# Altium project MB1635.PrjPcb (part 4 of 4)
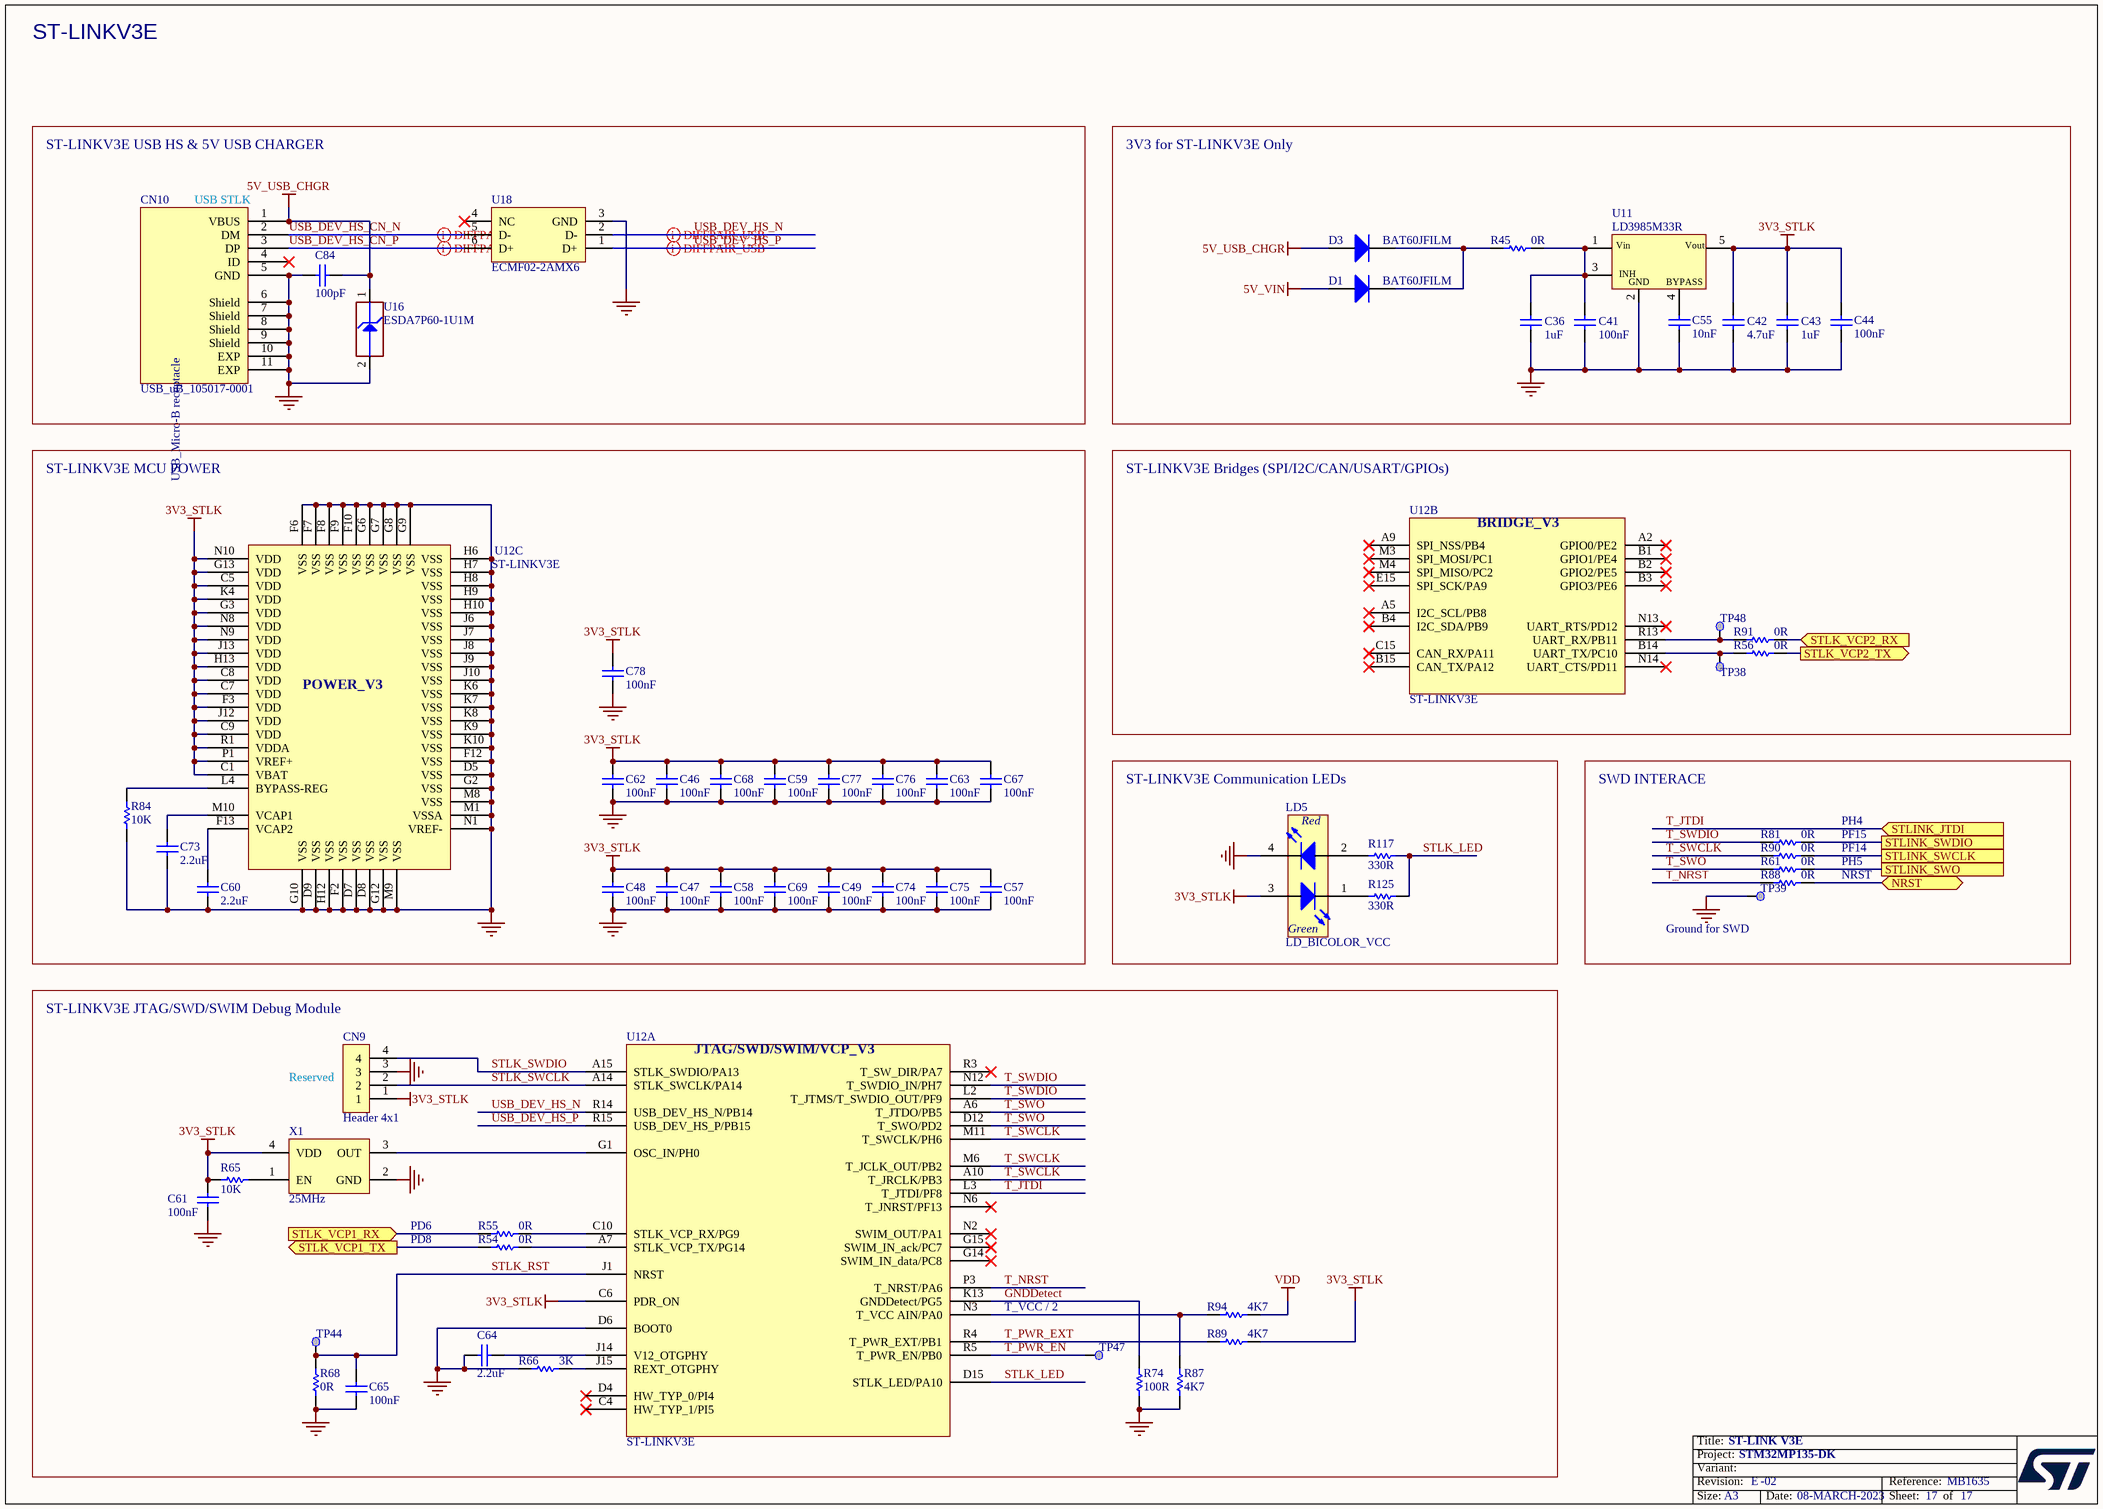
[diagram p9: ST-Link_V3E.SchDoc]

## Nets that join several sheets
3V3_AO: Power_Board (7 pins), Expansion_Connector (C7.1 CN8.1 CN8.17), MCP_IO_expander (C22.2 C23.2 R9.1 U5.5)
3V3_SW: Power_Board (TP49.1 U19.38), LCD4.3 (C50.1 C53.2 CN16.4)
5V_VIN: Power_Board (25 pins), LCD4.3 (R35.1), USB_TypeC_DRP (C86.2 Q1.5 Q1.6), Expansion_Connector (C8.2 CN8.2 CN8.4), ST-Link_V3E (D1.1)
GND: MP135_11x11 (9 pins), Power_MPU (112 pins), Power_Board (62 pins), LCD4.3 (23 pins), USB_TypeC_DRP (29 pins), Expansion_Connector (10 pins), MCP_IO_expander (6 pins), ST-Link_V3E (87 pins)
PWR_ON_DB: Power_Board (U19.35), USB_TypeC_DRP (C102.2 Q2.5 Q2.6)
VDD: MP135_11x11 (8 pins), Power_MPU (35 pins), Power_Board (9 pins), USB_TypeC_DRP (11 pins), ST-Link_V3E (R94.2)
VDD_ADC: Power_MPU (C214.1 R133.2 U14.U8), Power_Board (C132.2 TP66.1 U19.23)
VDD_CORE: Power_MPU (23 pins), Power_Board (5 pins)
VDD_CPU: Power_MPU (16 pins), Power_Board (5 pins)
VDD_DDR: Power_MPU (20 pins), Power_Board (5 pins)
VDD_USB: Power_MPU (C119.2 U14.W14), Power_Board (CN14.5 R113.2)
DFSDM1_CKOUT: MP135_11x11 (U14.W6), Expansion_Connector (CN8.13)
DFSDM1_DATIN3: MP135_11x11 (U14.W4), Expansion_Connector (CN8.15)
EXP_GPIO2: MP135_11x11 (R108.1 U14.N3), LCD4.3 (CN16.40), Expansion_Connector (CN8.3)
EXP_GPIO3: MP135_11x11 (R82.1 U14.C5), LCD4.3 (CN16.39), Expansion_Connector (CN8.5)
EXP_GPIO4: MP135_11x11 (U14.Y8), Expansion_Connector (CN8.7)
EXP_GPIO5: MP135_11x11 (TP50.1 U14.T2), Expansion_Connector (CN8.29)
EXP_GPIO6: MP135_11x11 (R96.2), Expansion_Connector (CN8.31)
EXP_GPIO7: MP135_11x11 (U14.H3), Expansion_Connector (CN8.26)
EXP_GPIO8: MP135_11x11 (U14.K3), Expansion_Connector (CN8.24)
EXP_GPIO9: MP135_11x11 (U14.P2), Expansion_Connector (CN8.21)
EXP_GPIO10: MP135_11x11 (U14.R3), Expansion_Connector (CN8.19)
EXP_GPIO11: MP135_11x11 (U14.J1), Expansion_Connector (CN8.23)
EXP_GPIO12: MP135_11x11 (U14.W10), Expansion_Connector (CN8.32)
EXP_GPIO13: MP135_11x11 (R85.1), Expansion_Connector (CN8.33)
EXP_GPIO14: MP135_11x11 (U14.W5), Expansion_Connector (CN8.8)
EXP_GPIO15: MP135_11x11 (U14.W8), Expansion_Connector (CN8.10)
EXP_GPIO16: MP135_11x11 (U14.V6), Expansion_Connector (CN8.36)
EXP_GPIO17: MP135_11x11 (U14.AA10), Expansion_Connector (CN8.11)
EXP_GPIO18: MP135_11x11 (U14.AA6), Expansion_Connector (CN8.12)
EXP_GPIO19: MP135_11x11 (U14.Y6), Expansion_Connector (CN8.35)
EXP_GPIO20: MP135_11x11 (U14.Y5), Expansion_Connector (CN8.38)
EXP_GPIO21: MP135_11x11 (U14.Y3), Expansion_Connector (CN8.40)
EXP_GPIO23: MP135_11x11 (U14.R1), Expansion_Connector (CN8.16)
EXP_GPIO24: MP135_11x11 (U14.W1), Expansion_Connector (CN8.18)
EXP_GPIO25: MP135_11x11 (U14.P5), Expansion_Connector (CN8.22)
EXP_GPIO26: MP135_11x11 (U14.E8), Expansion_Connector (CN8.37)
I2C1_SCL: MP135_11x11 (R62.1 U14.A6), USB_TypeC_DRP (U21.26), Expansion_Connector (CN8.28), MCP_IO_expander (R11.1)
I2C1_SDA: MP135_11x11 (R63.1 U14.B9), USB_TypeC_DRP (U21.27), Expansion_Connector (CN8.27), MCP_IO_expander (R10.1)
I2C4_SCL: MP135_11x11 (R75.1 U14.A9), Power_Board (U19.4)
I2C4_SDA: MP135_11x11 (R71.1 U14.A15), Power_Board (U19.3)
LCD_B2: MP135_11x11 (U14.D6), LCD4.3 (CN16.23)
LCD_B3: MP135_11x11 (U14.D11), LCD4.3 (CN16.24)
LCD_B4: MP135_11x11 (U14.B8), LCD4.3 (CN16.25)
LCD_B5: MP135_11x11 (U14.B6), LCD4.3 (CN16.26)
LCD_B6: MP135_11x11 (U14.C1), LCD4.3 (CN16.27)
LCD_B7: MP135_11x11 (U14.B11), LCD4.3 (CN16.28)
LCD_BL: MP135_11x11 (U14.A4), LCD4.3 (R57.1)
LCD_CLK: MP135_11x11 (U14.C9), LCD4.3 (CN16.30 TP41.1)
LCD_DE: MP135_11x11 (U14.C12), LCD4.3 (CN16.34 TP40.1)
LCD_DISP: MP135_11x11 (U14.AA20), LCD4.3 (CN16.31 R59.2)
LCD_G2: MP135_11x11 (U14.A12), LCD4.3 (CN16.15)
LCD_G3: MP135_11x11 (U14.A13), LCD4.3 (CN16.16)
LCD_G4: MP135_11x11 (U14.C8), LCD4.3 (CN16.17)
LCD_G5: MP135_11x11 (U14.A7), LCD4.3 (CN16.18)
LCD_G6: MP135_11x11 (U14.C13), LCD4.3 (CN16.19)
LCD_G7: MP135_11x11 (U14.B4), LCD4.3 (CN16.20)
LCD_HSYNC: MP135_11x11 (U14.B14), LCD4.3 (CN16.32 TP43.1)
LCD_INT: MP135_11x11 (U14.B3), LCD4.3 (CN16.38 TP42.1)
LCD_R2: MP135_11x11 (U14.A10), LCD4.3 (CN16.7)
LCD_R3: MP135_11x11 (U14.C11), LCD4.3 (CN16.8)
LCD_R4: MP135_11x11 (U14.C4), LCD4.3 (CN16.9)
LCD_R5: MP135_11x11 (U14.D8), LCD4.3 (CN16.10)
LCD_R6: MP135_11x11 (U14.A3), LCD4.3 (CN16.11)
LCD_R7: MP135_11x11 (U14.B7), LCD4.3 (CN16.12)
LCD_RST: MP135_11x11 (U14.E2), LCD4.3 (CN16.37 R58.1)
LCD_VSYNC: MP135_11x11 (U14.B10), LCD4.3 (CN16.33 TP37.1)
MCP_INT: MP135_11x11 (U14.W2), MCP_IO_expander (R12.1 R19.1 TP23.1)
NRST: MP135_11x11 (C118.1 U14.Y11), Power_Board (R114.1), USB_TypeC_DRP (D4.2), MCP_IO_expander (U5.14), ST-Link_V3E (R88.2)
PF8_WKUP: MP135_11x11 (U14.F1), Power_Board (U19.43)
PMIC_WAKEUP: MP135_11x11 (U14.M3), Power_Board (U19.2)
STLINK_SWCLK: MP135_11x11 (U14.Y2), ST-Link_V3E (R90.2)
STLINK_SWDIO: MP135_11x11 (U14.Y12), ST-Link_V3E (R81.2)
STLINK_SWO: MP135_11x11 (U14.W18), ST-Link_V3E (R61.2)
STM32G0_INTN: MP135_11x11 (U14.N5), USB_TypeC_DRP (TP59.1 U21.28)
STM32G0_WAKE: MP135_11x11 (U14.AA19), USB_TypeC_DRP (TP58.1 U21.25)
T_JTDI: MP135_11x11 (R189.1), ST-Link_V3E (U12.L3)
USB_D2_N: MP135_11x11 (U14.Y13), USB_TypeC_DRP (U32.2)
USB_D2_P: MP135_11x11 (U14.AA13), USB_TypeC_DRP (U32.1)
USB_PWR_CC1: MP135_11x11 (U14.AA4), Power_Board (R149.2)
USB_PWR_CC2: MP135_11x11 (U14.W9), Power_Board (R144.2)

## Assembly variants
MP135F: not fitted C1 C2 C3 C4 C21 C34 C54 C66 C72 C87 C124 C133 CN9 CN13 R5 R19 R20 R24 R26 R34 R68 R73 R78 R107 R141 R161 R164 R165 R166 R167 R170 R171 R189 R191 U40 U41